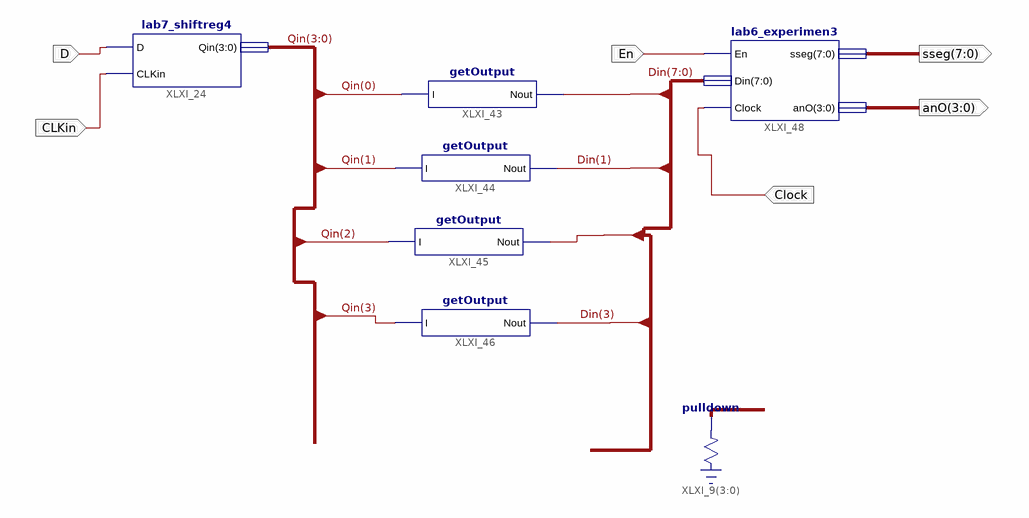
[diagram p0: schematic sheet 1]
// Xilinx ISE schematic lab7_experiment7_1.sch (spartan3e) as structural Verilog: 7 symbols, 6 ports
module lab7_experiment7_1 (
  input  En,
  input  D,
  input  CLKin,
  input  Clock,
  output [7:0] sseg,
  output [3:0] anO
);

  wire [3:0] Qin;
  wire [7:0] Din;

  \pulldown  XLXI_9[3:0] (.O(Din[7:4]));
  lab7_shiftreg4 XLXI_24 (.D(D), .CLKin(CLKin), .Qin(Qin));
  getOutput XLXI_43 (.I(Qin[0]), .Nout(Din[0]));
  getOutput XLXI_44 (.I(Qin[1]), .Nout(Din[1]));
  getOutput XLXI_45 (.I(Qin[2]), .Nout(Din[2]));
  getOutput XLXI_46 (.I(Qin[3]), .Nout(Din[3]));
  lab6_experimen3 XLXI_48 (.En(En), .Din(Din), .Clock(Clock), .sseg(sseg), .anO(anO));
endmodule
